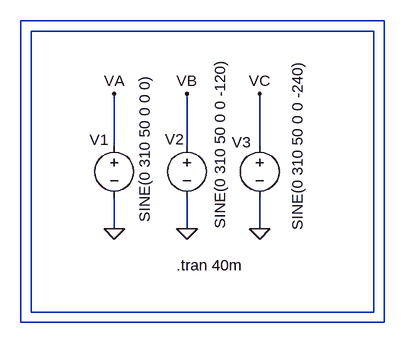
[diagram p0: schematic Three Phase.asc]
Three Phase.asc, the LTspice schematic file:
Version 4
SHEET 1 1088 680
WIRE 464 -64 -96 -64
WIRE 448 -48 -80 -48
WIRE 48 128 48 48
WIRE 160 128 160 48
WIRE 272 128 272 48
WIRE 48 256 48 208
WIRE 160 256 160 208
WIRE 272 256 272 208
WIRE -80 384 -80 -48
WIRE 448 384 448 -48
WIRE 448 384 -80 384
WIRE -96 400 -96 -64
WIRE 464 400 464 -64
WIRE 464 400 -96 400
FLAG 48 256 0
FLAG 48 48 VA
FLAG 160 256 0
FLAG 160 48 VB
FLAG 272 256 0
FLAG 272 48 VC
SYMBOL voltage 48 112 R0
WINDOW 0 -38 7 Left 2
WINDOW 3 47 -93 VRight 2
WINDOW 123 0 0 Left 0
WINDOW 39 0 0 Left 0
SYMATTR InstName V1
SYMATTR Value SINE(0 310 50 0 0 0)
SYMBOL voltage 160 112 R0
WINDOW 0 -34 6 Left 2
WINDOW 3 51 144 VLeft 2
WINDOW 123 0 0 Left 0
WINDOW 39 0 0 Left 0
SYMATTR InstName V2
SYMATTR Value SINE(0 310 50 0 0 -120)
SYMBOL voltage 272 112 R0
WINDOW 0 -43 11 Left 2
WINDOW 3 58 -116 VRight 2
WINDOW 123 0 0 Left 0
WINDOW 39 0 0 Left 0
SYMATTR InstName V3
SYMATTR Value SINE(0 310 50 0 0 -240)
TEXT 144 312 Left 2 !.tran 40m

The netlist it stands for:
* Three Phase.asc
V1 VA 0 SINE(0 310 50 0 0 0)
V2 VB 0 SINE(0 310 50 0 0 -120)
V3 VC 0 SINE(0 310 50 0 0 -240)
.tran 40m
.backanno
.end